# Altium schematic sheet Sheet3.SchDoc
size A; SheetNumber: 1; SheetTotal: 1
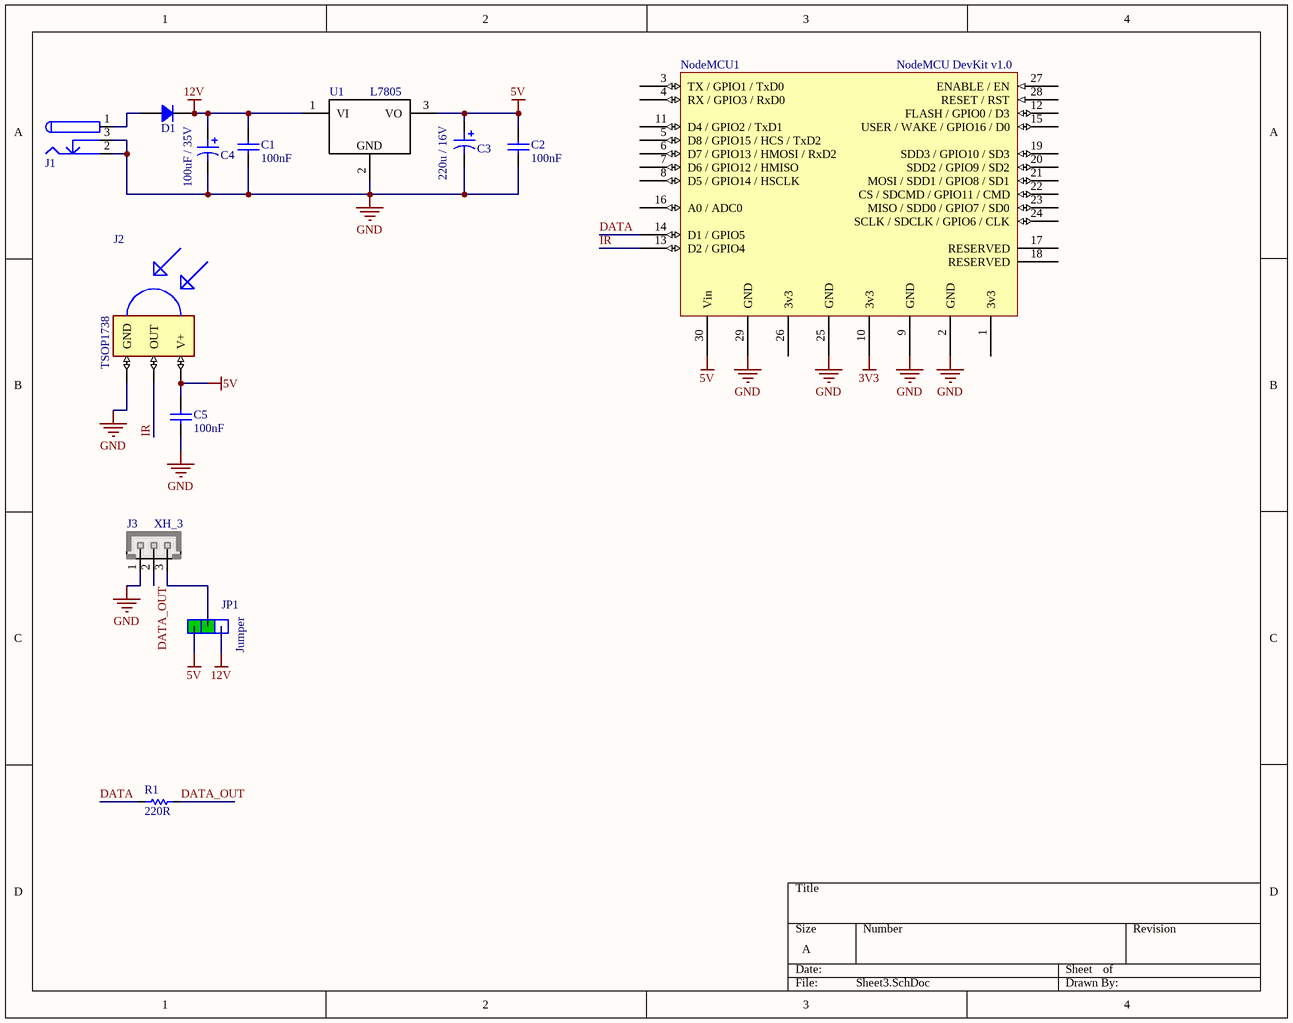
[diagram p0: Sheet3.SchDoc]

## Parts
C1  100nF  [CAPC4817X12N]
C2  100nF  [CAPC4817X12N]
C3  220u / 16V  [Cap electrolitic radial 8x12-3.5]
C4  100uF / 35V  [Cap electrolitic radial 10x20-5]
C5  100nF  [CAPC4817X12N]
D1  1N4007  [DO41 P7.5MM]  (value not drawn)
J1  DC Power Jack  [DC Power Jack 1]  (value not drawn)
J2  TSOP1738  [TSOP17XX]
J3  XH_3  [XH_3]
JP1  Jumper  [jumper selector]
NodeMCU1  NodeMCU DevKit v1.0  [NODEMCU]
R1  220R  [Res-(1/4)]
U1  L7805  [to220-123-v]

## Nets
3V3: NodeMCU1.10(3v3)
5V: C2.1 C3.1 C5.1 J2.V+ JP1.1 NodeMCU1.30(Vin) U1.3(VO)
12V: C1.2 C4.1 D1.2 JP1.3 U1.1(VI)
GND: C1.1 C2.2 C3.2 C4.2 C5.2 J1.2 J1.3 J2.GND J3.1 NodeMCU1.2(GND) NodeMCU1.9(GND) NodeMCU1.25(GND) NodeMCU1.29(GND) U1.2
DATA: NodeMCU1.14(D1_/_GPIO5) R1.1
DATA_OUT: J3.2 R1.2
IR: J2.OUT NodeMCU1.13(D2_/_GPIO4)
NetD1_1: D1.1 J1.1
NetJ3_3: J3.3 JP1.2

Not connected (* = marked no-connect by the designer): NodeMCU1 1(3v3) 3(TX_/_GPIO1_/_TxD0) 4(RX_/_GPIO3_/_RxD0) 5(D8_/_GPIO15_/_HCS_/_TxD2) 6(D7_/_GPIO13_/_HMOSI_/_RxD2) 7(D6_/_GPIO12_/_HMISO) 8(D5_/_GPIO14_/_HSCLK) 11(D4_/_GPIO2_/_TxD1) 12(FLASH_/_GPIO0_/_D3) 15(USER_/_WAKE_/_GPIO16_/_D0) 16(A0_/_ADC0) 17(RESERVED) 18(RESERVED) 19(SDD3_/_GPIO10_/_SD3) 20(SDD2_/_GPIO9_/_SD2) 21(MOSI_/_SDD1_/_GPIO8_/_SD1) 22(CS_/_SDCMD_/_GPIO11_/_CMD) 23(MISO_/_SDD0_/_GPIO7_/_SD0) 24(SCLK_/_SDCLK_/_GPIO6_/_CLK) 26(3v3) 27(ENABLE_/_EN) 28(RESET_/_RST)

## Notes on the sheet
- (in symbol L7805-TO220) GND

## Library data of the parts
C1 C2 C5 = CAP SMD 1206: CAP 1206; Designer: Abbas Basereh; Desc.: CAP SMD 1206; Data: 16-12-2016
C3 C4 = Cap ELECTROLITIC TOTAL SIZE: Cap electrolitic radial; Designer: Abbas Basereh; Data: 16-12-2016; Part. No: *
  C3: VALUE: 220u / 16V
  C4: VALUE: 100uF / 35V
D1 = 1N4007 (THD): Diode Standard 1000V 1A Through Hole DO-204AL (DO-41); PartNumber: 1N4007
J1 = DC Power Jack: DC Power Jack. Center Pin 2.5mm. Diameter: 5.7mm; Designer: Ali Hafizi; Company: Personal; Project Name: Laser; Adding Date: 10/21/2009
J2 = TSOP1738: IR Remote Receiver 38KHz 35m 3-Pin; MP: TSOP1738.; MF: Vishay; Check_prices: https://www.snapeda.com/parts/TSOP1738./Vishay/view-part/?ref=eda; Value: *; Availability: Not in stock; Price: None; Package: DIP-3 Vishay; SnapEDA_Link: https://www.snapeda.com/parts/TSOP1738./Vishay/view-part/?ref=snap
J3 = XH_3: PW10-x-M, JST-BxB-XH-A pitch: 2.5mm, 3A/250v; MANF: JST; MANF_P#: B3B-XH-A; PARAM2: 250v; PARAM: 3.0A; VALUE: XH_3
JP1 = Jumper Selector
R1 = Resistor: Tolerance: 5%; Power: 1/4 W; Value: 220R
U1 = L7805-TO220: LINEAR REGULATOR 5.0V; Supplier 1: Mouser; Supplier Part Number 1: 511-L7805ACP